# EasyEDA Pro project MSPM0G3507.eprj, board V1
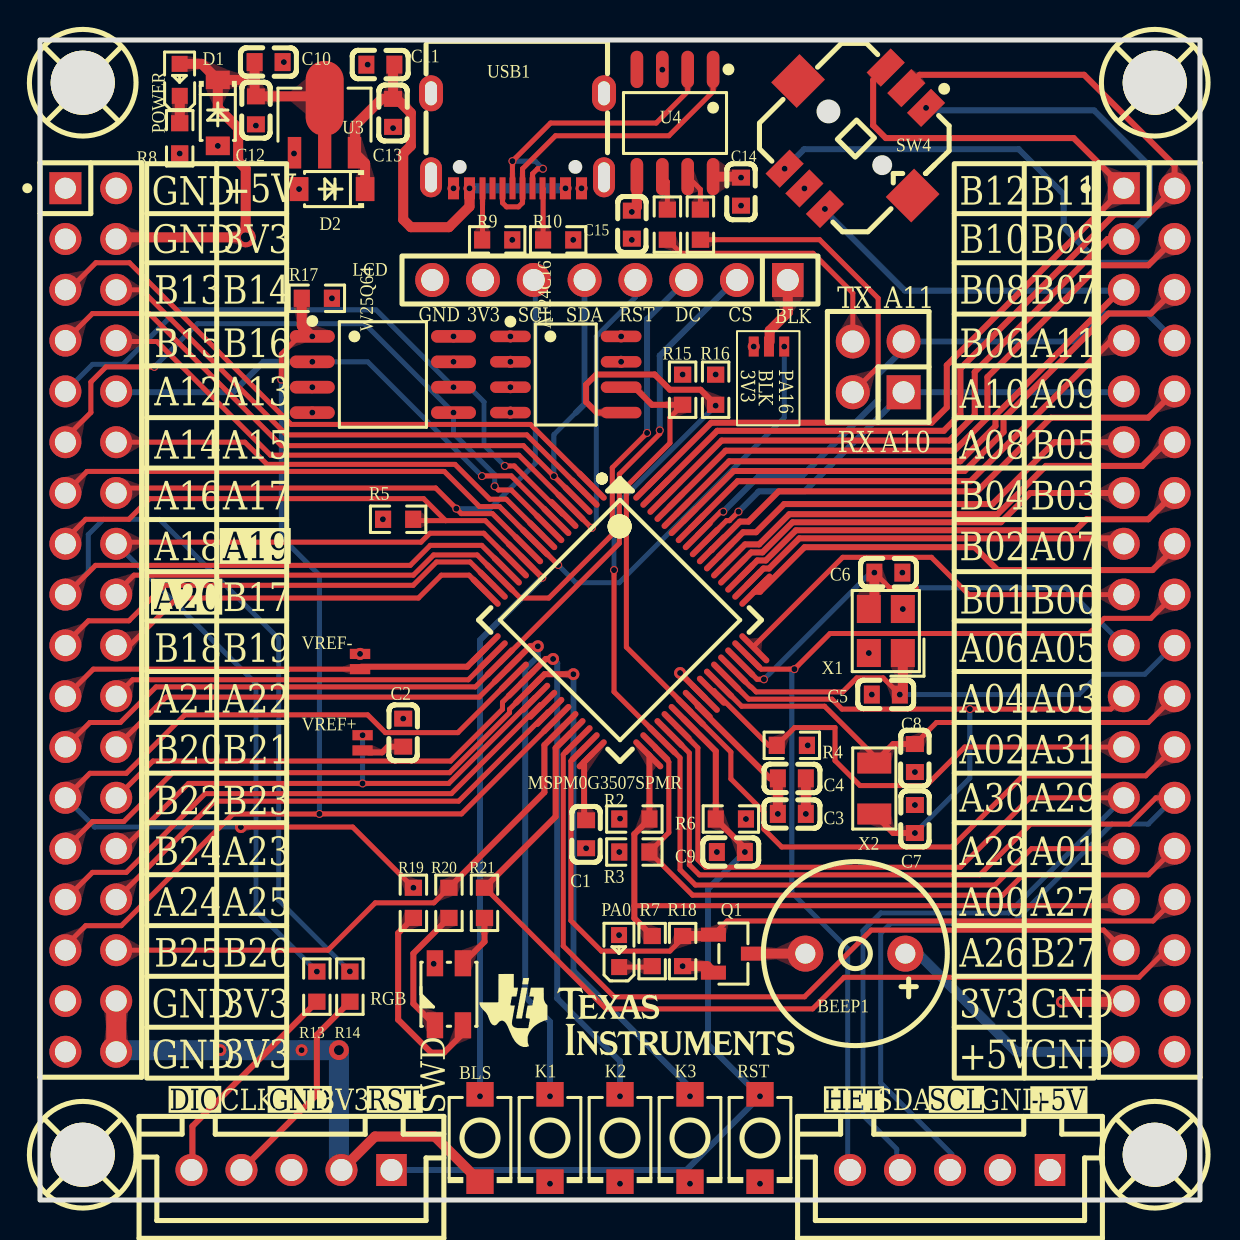
[diagram p1: board, top side]
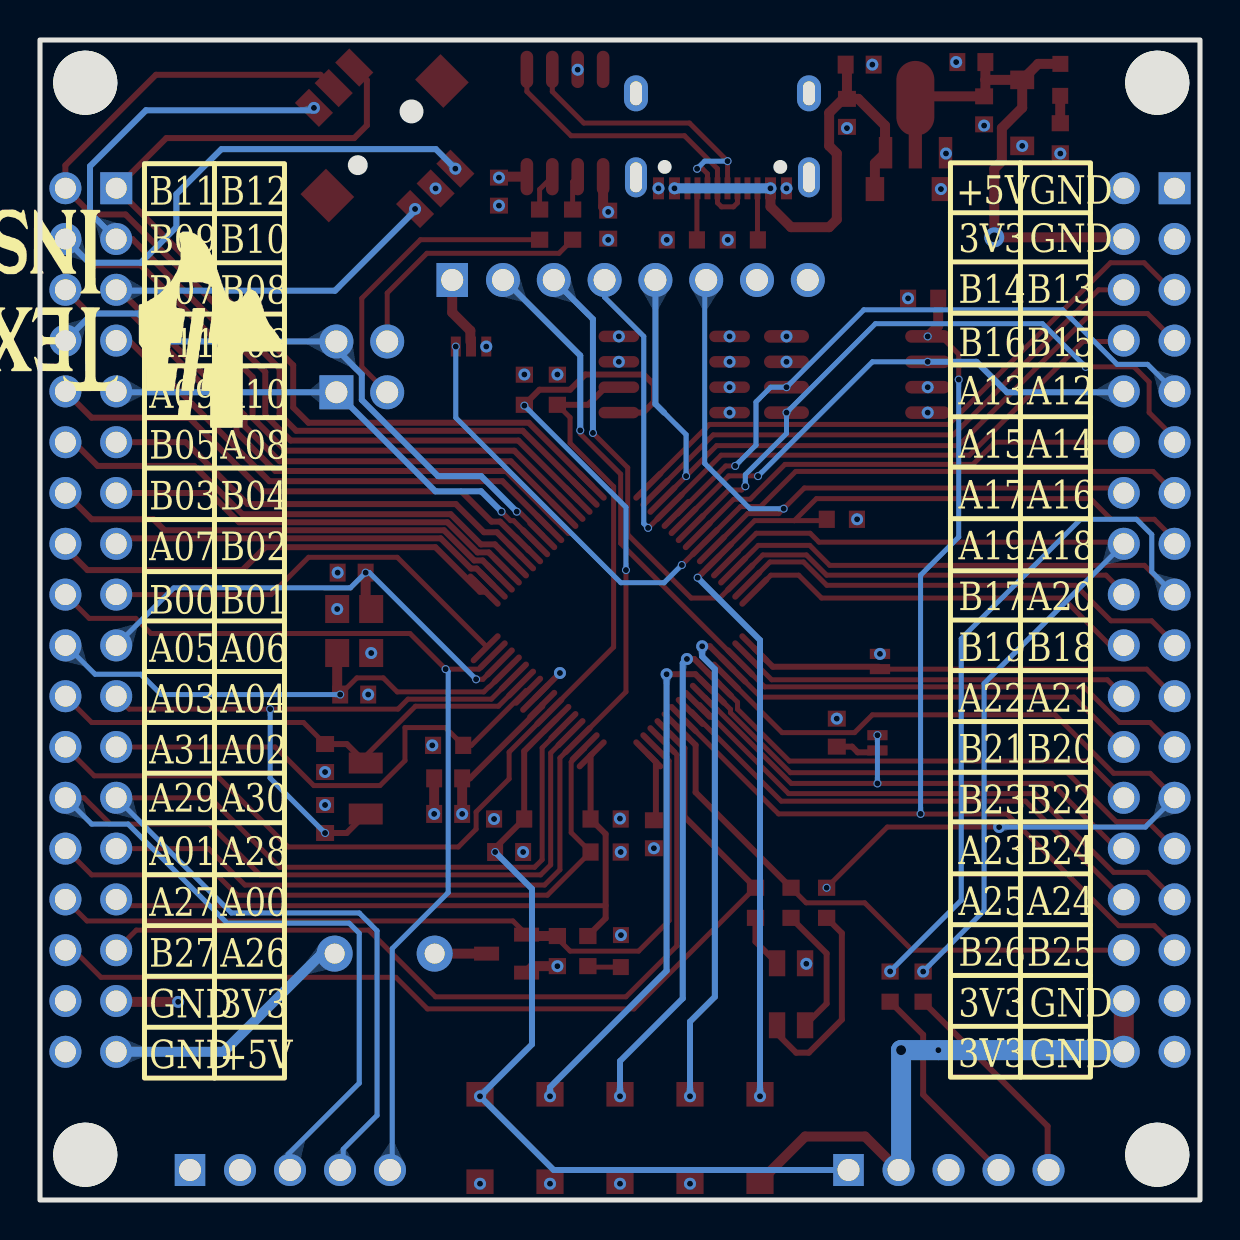
[diagram p2: board, bottom side, seen from below]

Outline 58 x 58 mm; copper layers: Top Layer, GND, VCC, Bottom Layer. Coordinates in mm from the lower left corner of the outline.
Outline path: rectangle 0,58 58,0
Stack: Top Layer 0.035mm / Dielectric1 0.48mm PP er 4.5 / GND 0.035mm / Dielectric2 0.48mm FR4 er 4.5 / VCC 0.035mm / Dielectric3 0.48mm PP er 4.5 / Bottom Layer 0.035mm

## Design rules (mm)
template: JLCPCB Capability(Multiple Layers Board)
spacing copperThickness1oz (default): track to track 0.102, other pairs 0.152 to 0.3
spacing copperThickness2oz: track to track 0.203, other pairs 0.152 to 0.3
spacing copperThicknessInner0.5oz: track to track 0.089, other pairs 0.152 to 0.3
track width copperThickness1oz (default): min 0.102, default 0.254, max 2.54
track width copperThickness2oz: min 0.203, default 0.254, max 2.54
track width copperThickness0.5oz: min 0.089, default 0.254, max 2.54
differential pair differentialPair (default): width min 0.127, default 0.254, max 2.54; gap min 0.152, default 0.152
via viaSize (default): diameter min 0.3, default 0.61, max 10; hole min 0.2, default 0.305, max 6.3

## Placement (name value [footprint] x y rotation side)
AT24C16  AT24C16  [SOP-8_L5.0-W4.0-P1.27-LS6.0-BL]  26.29 41.28 270 top
BEEP1  3kHz  [BUZ-TH_BD9.0-P5.00-D0.6-FD]  40.77 12.32 180 top
BL/SDO1  -  [3焊盘短接]  37.47 42.16 90 top
BLS  BSL  [SW-SMD_L3.9-W3.0-P4.45]  22 3.1 270 top
C1  470nF  [C0603]  27.31 18.29 90 top
C2  1uF  [C0603]  18.16 23.37 90 top
C3  1uF  [C0603]  37.59 19.3 180 top
C4  100nF  [C0603]  37.59 21.08 180 top
C5  22pF  [C0603]  42.29 25.27 0 top
C6  22pF  [C0603]  42.42 31.37 180 top
C7  22pF  [C0603]  43.75 19.05 270 top
C8  22pF  [C0603]  43.75 22.1 90 top
C9  10nF  [C0603]  34.54 17.4 0 top
C10  22uF  [C0603]  11.43 56.9 0 top
C11  22uF  [C0603]  17.02 56.77 0 top
C12  100nF  [C0603]  10.79 54.48 270 top
C13  100nF  [C0603]  17.65 54.36 90 top
C14  100nF  [C0603]  35.05 50.42 90 top
C15  100nF  [C0603]  29.59 48.77 270 top
CBSL1  PZ254V-12-4P  [HDR-TH_4P-P2.54-V-M-R2-C2-S2.54]  41.91 41.66 90 top
D1  K34  [SOD-123FL_L2.8-W1.8-LS3.7-RD-1]  8.89 54.36 270 top
D2  K34  [SOD-123FL_L2.8-W1.8-LS3.7-RD-1]  14.6 50.55 180 top
H1  X6521WV-2x18H-C60D30  [HDR-TH_36P-2.54-V-M-R2-C18-S2.54]  2.54 29 270 top
H2  X6521WV-2x18H-C60D30  [HDR-TH_36P-2.54-V-M-R2-C18-S2.54]  55.46 29 270 top
IMU1  imu  [CONN-TH_5P-P2.50_ZX-XH2.54-5PZZ]  45.5 1.5 180 top
K1  K1  [SW-SMD_L3.9-W3.0-P4.45]  25.5 3.1 270 top
K2  K2  [SW-SMD_L3.9-W3.0-P4.45]  29 3.1 270 top
K3  K3  [SW-SMD_L3.9-W3.0-P4.45]  32.5 3.1 270 top
LCD  PM254-1-08-Z-8.5  [HDR-TH_8P-P2.54-V-F]  28.5 46 180 top
MSPM0G3507SPMR  MSPM0G3507SPMR  [LQFP-64_L10.0-W10.0-P0.50-LS12.0-BL]  29 29 225 top
PA0  LED  [LED0603-RD_RED]  28.96 12.45 90 top
POWER  NCD0603R1  [LED0603-RD_RED]  6.98 56.01 90 top
Q1  SI2302  [SOT-23-3_L2.9-W1.3-P1.90-LS2.4-BR]  34.67 12.32 180 top
R2  4.7kΩ  [R0603]  29.72 19.05 0 top
R3  4.7kΩ  [R0603]  29.72 17.4 0 top
R4  100kΩ  [R0603]  37.59 22.73 0 top
R5  47kΩ  [R0603]  17.91 34.04 0 top
R6  47kΩ  [R0603]  34.54 19.05 0 top
R7  510Ω  [R0603]  30.61 12.45 270 top
R8  510Ω  [R0603]  6.98 53.09 270 top
R9  5.1kΩ  [R0603]  22.86 48.01 0 top
R10  5.1kΩ  [R0603]  25.91 48.01 0 top
R11  1.2kΩ  [R0603]  33.02 48.77 270 top
R12  1.2kΩ  [R0603]  31.37 48.77 270 top
R13  100Ω  [R0603]  13.84 10.67 90 top
R14  100Ω  [R0603]  15.49 10.67 90 top
R15  4.7kΩ  [R0603]  32.13 40.51 90 top
R16  4.7kΩ  [R0603]  33.78 40.51 90 top
R17  4.7kΩ  [R0603]  13.84 45.08 0 top
R18  10kΩ  [R0603]  32.13 12.45 90 top
R19  510Ω  [R0603]  18.67 14.86 270 top
R20  510Ω  [R0603]  20.45 14.86 270 top
R21  510Ω  [R0603]  22.22 14.86 270 top
RGB  RGB  [LED-ARRAY-SMD_4P-L3.2-W2.8-LS3.5-BL_XL-A3528RGBC-BM]  20.45 10.29 270 top
RST  RST  [SW-SMD_L3.9-W3.0-P4.45]  36 3.1 270 top
SCREW1  -  [M3螺丝]  2.2 2.2 0 top
SCREW2  -  [M3螺丝]  2.2 55.8 0 top
SCREW3  -  [M3螺丝]  55.8 55.8 0 top
SCREW4  -  [M3螺丝]  55.8 2.2 0 top
SW4  TM-4175-B-A  [SW-SMD_TM-4175-B-X]  40.77 53.09 225 top
SWD  swd  [CONN-TH_5P-P2.50_ZX-XH2.54-5PZZ]  12.57 1.5 180 top
U3  AMS1117-3.3  [SOT-89_L4.5-W2.5-P1.50-LS4.2-BR]  14.22 53.72 270 top
U4  CH340N  [SOP-8_L4.9-W3.9-P1.27-LS6.0-BL]  31.75 53.85 180 top
USB1  TYPE-C 16PIN 2MD(073)  [USB-C-SMD_TYPE-C-6PIN-2MD-073]  23.88 52.96 180 top
VREF+  -  [VREF]  15.62 22.22 0 top
VREF-  -  [VREF]  15.49 26.29 0 top
W25Q64  W25Q64  [SOIC-8_L5.3-W5.3-P1.27-LS8.0-BL]  17.15 41.28 270 top
X1  40MHz  [CRYSTAL-SMD_4P-L3.2-W2.5-BL]  42.29 28.45 90 top
X2  32.768kHz  [OSC-SMD_L3.2-W1.5]  41.71 20.57 90 top

## Footprints (pads in the part's own frame, mm; a bottom-side part is the same pattern mirrored in y, then rotated)
3焊盘短接
  custom 1x0.5 smd: 1(0.508,1.778) 2(0.508,1.016) 3(0.508,0.254)
BUZ-TH_BD9.0-P5.00-D0.6-FD
  round 1.8 hole 1: 1(-2.5,0) 2(2.5,0)
C0603
  rect 0.8x0.9 smd: 1(-0.7,0) 2(0.7,0)
CONN-TH_5P-P2.50_ZX-XH2.54-5PZZ
  rect 1.524x1.6 hole 1.1: 1(-5,0)
  round 1.6 hole 1.1: 2(-2.5,0) 3(0,0) 4(2.5,0) 5(5,0)
CRYSTAL-SMD_4P-L3.2-W2.5-BL
  rect 1.4x1.2 smd: 1(-1.1,-0.85) 2(1.1,-0.85) 3(1.1,0.85) 4(-1.1,0.85)
HDR-TH_4P-P2.54-V-M-R2-C2-S2.54
  rect 1.7x1.7 hole 1.1: 1(-1.27,-1.27)
  round 1.7 hole 1.1: 2(-1.27,1.27) 3(1.27,-1.27) 4(1.27,1.27)
HDR-TH_8P-P2.54-V-F
  rect 1.575x1.7 hole 1.1: 1(-8.89,0)
  round 1.7 hole 1.1: 2(-6.35,0) 3(-3.81,0) 4(-1.27,0) 5(1.27,0) 6(3.81,0) 7(6.35,0) 8(8.89,0)
HDR-TH_36P-2.54-V-M-R2-C18-S2.54
  rect 1.6x1.6 hole 1.05: 1(-21.59,-1.27)
  round 1.6 hole 1.05: 2(-21.59,1.27) 3(-19.05,-1.27) 4(-19.05,1.27) 5(-16.51,-1.27) 6(-16.51,1.27) 7(-13.97,-1.27) 8(-13.97,1.27) 9(-11.43,-1.27) 10(-11.43,1.27) 11(-8.89,-1.27) 12(-8.89,1.27) 13(-6.35,-1.27) 14(-6.35,1.27) 15(-3.81,-1.27) 16(-3.81,1.27) 17(-1.27,-1.27) 18(-1.27,1.27) 19(1.27,-1.27) 20(1.27,1.27) 21(3.81,-1.27) 22(3.81,1.27) 23(6.35,-1.27) 24(6.35,1.27) 25(8.89,-1.27) 26(8.89,1.27) 27(11.43,-1.27) 28(11.43,1.27) 29(13.97,-1.27) 30(13.97,1.27) 31(16.51,-1.27) 32(16.51,1.27) 33(19.05,-1.27) 34(19.05,1.27) 35(21.59,-1.27) 36(21.59,1.27)
LED0603-RD_RED
  rect 0.8x0.8 smd: 1(-0.799,-0.004) 2(0.799,0.004)
LED-ARRAY-SMD_4P-L3.2-W2.8-LS3.5-BL_XL-A3528RGBC-BM
  rect 1.3x0.82 smd: 1(-1.55,-0.7) 2(-1.55,0.7) 3(1.55,-0.7) 4(1.55,0.7)
LQFP-64_L10.0-W10.0-P0.50-LS12.0-BL
  oval 0.3x2 smd: 1(-3.75,-5.75) 2(-3.25,-5.75) 3(-2.75,-5.75) 4(-2.25,-5.75) 5(-1.75,-5.75) 6(-1.25,-5.75) 7(-0.75,-5.75) 8(-0.25,-5.75) 9(0.25,-5.75) 10(0.75,-5.75) 11(1.25,-5.75) 12(1.75,-5.75) 13(2.25,-5.75) 14(2.75,-5.75) 15(3.25,-5.75) 16(3.75,-5.75) 33(3.75,5.75) 34(3.25,5.75) 35(2.75,5.75) 36(2.25,5.75) 37(1.75,5.75) 38(1.25,5.75) 39(0.75,5.75) 40(0.25,5.75) 41(-0.25,5.75) 42(-0.75,5.75) 43(-1.25,5.75) 44(-1.75,5.75) 45(-2.25,5.75) 46(-2.75,5.75) 47(-3.25,5.75) 48(-3.75,5.75)
  oval 2x0.3 smd: 17(5.75,-3.75) 18(5.75,-3.25) 19(5.75,-2.75) 20(5.75,-2.25) 21(5.75,-1.75) 22(5.75,-1.25) 23(5.75,-0.75) 24(5.75,-0.25) 25(5.75,0.25) 26(5.75,0.75) 27(5.75,1.25) 28(5.75,1.75) 29(5.75,2.25) 30(5.75,2.75) 31(5.75,3.25) 32(5.75,3.75) 49(-5.75,3.75) 50(-5.75,3.25) 51(-5.75,2.75) 52(-5.75,2.25) 53(-5.75,1.75) 54(-5.75,1.25) 55(-5.75,0.75) 56(-5.75,0.25) 57(-5.75,-0.25) 58(-5.75,-0.75) 59(-5.75,-1.25) 60(-5.75,-1.75) 61(-5.75,-2.25) 62(-5.75,-2.75) 63(-5.75,-3.25) 64(-5.75,-3.75)
M3螺丝
  round 3.2 hole 3.2: 1(-0.064,0.064)
OSC-SMD_L3.2-W1.5
  rect 1.05x1.7 smd: 1(-1.275,0) 2(1.275,0)
R0603
  rect 0.806x0.864 smd: 1(-0.753,0) 2(0.753,0)
SOD-123FL_L2.8-W1.8-LS3.7-RD-1
  rect 0.93x1.2 smd: 1(-1.65,0) 2(1.65,0)
SOIC-8_L5.3-W5.3-P1.27-LS8.0-BL
  oval 0.63x2.25 smd: 1(-1.905,-3.53) 2(-0.635,-3.53) 3(0.635,-3.53) 4(1.905,-3.53) 5(1.905,3.53) 6(0.635,3.53) 7(-0.635,3.53) 8(-1.905,3.53)
SOP-8_L4.9-W3.9-P1.27-LS6.0-BL
  oval 0.63x1.865 smd: 1(-1.905,-2.683) 2(-0.635,-2.683) 3(0.635,-2.683) 4(1.905,-2.683) 5(1.905,2.683) 6(0.635,2.683) 7(-0.635,2.683) 8(-1.905,2.683)
SOP-8_L5.0-W4.0-P1.27-LS6.0-BL
  oval 0.574x2.035 smd: 1(-1.905,-2.768) 2(-0.635,-2.768) 3(0.635,-2.768) 4(1.905,-2.768) 5(1.905,2.768) 6(0.635,2.768) 7(-0.635,2.768) 8(-1.905,2.768)
SOT-23-3_L2.9-W1.3-P1.90-LS2.4-BR
  rect 1.25x0.7 smd: 1(1,-0.95) 2(1,0.95) 3(-1,0)
SOT-89_L4.5-W2.5-P1.50-LS4.2-BR
  rect 1.575x0.672 smd: 1(1.356,-1.5) 3(1.356,1.5)
  custom 5.377x1.9 smd: 2(-1.356,0.009)
SW-SMD_L3.9-W3.0-P4.45
  rect 1.23x1.36 smd: 1(-2.185,0) 2(2.185,0)
SW-SMD_TM-4175-B-X
  rect 1.7x1 smd: 1(-3.575,1.425) 2(-3.575,0.028) 3(-3.575,-1.425) 4(3.575,1.425) 5(3.575,-0.028) 6(3.575,-1.425)
  rect 2x1.8 smd: 7(0,4.05) 7(0,-4.05)
USB-C-SMD_TYPE-C-6PIN-2MD-073
  rect 0.55x1.1 smd: 1(-3.2,2.375) 2(-2.4,2.375) 11(2.4,2.375) 12(3.2,2.375)
  rect 0.3x1.1 smd: 3(-1.75,2.375) 4(-1.25,2.375) 5(-0.75,2.375) 6(-0.25,2.375) 7(0.25,2.375) 8(0.75,2.375) 9(1.25,2.375) 10(1.75,2.375)
  oval 1.1x2 hole 0.6x1.5: 13(-4.325,1.825) 14(4.325,1.825)
  oval 1.2x1.8 hole 0.6x1.2: 13(-4.325,-2.375) 14(4.325,-2.375)
VREF
  custom 1.016x0.508 smd: 1(0.508,1.016) 2(0.508,0.254)

## Nets
3V3: AT24C16.8 BL/SDO1.1 BLS.2 C3.2 C4.2 C10.1 C12.1 C14.2 C15.1 D1.1 H1.4 H1.34 H1.36 H2.33 LCD.7 MSPM0G3507SPMR.40 PA0.2 POWER.2 R2.1 R3.1 R6.2 R15.2 R16.2 R17.2 SWD.2 U3.2 U4.5 U4.8 W25Q64.3 W25Q64.7 W25Q64.8
GND: AT24C16.1 AT24C16.2 AT24C16.3 AT24C16.4 AT24C16.7 C1.1 C2.2 C3.1 C4.1 C5.1 C6.1 C7.1 C8.1 C9.1 C10.2 C11.1 C12.2 C13.1 C14.1 C15.2 D1.2 D2.2 H1.1 H1.3 H1.33 H1.35 H2.34 H2.36 IMU1.2 K1.2 K2.2 K3.2 LCD.8 MSPM0G3507SPMR.41 Q1.2 R4.2 R5.1 R8.2 R9.2 R10.2 R18.1 RGB.1 RST.2 SW4.5 SWD.3 U3.1 U4.3 USB1.1 USB1.12 USB1.13 USB1.14 VREF-.1 W25Q64.4 X1.2 X1.4
VCC_5V: BEEP1.1 C11.2 C13.2 D2.1 H1.2 H2.35 IMU1.1 U3.3 USB1.2 USB1.11
A0_PWM_CH0: H1.6 MSPM0G3507SPMR.2
A0_PWM_CH1: C8.2 H2.22 MSPM0G3507SPMR.43 X2.2
A0_PWM_CH2: H2.16 MSPM0G3507SPMR.49
A0_PWM_CH3: C7.2 H2.21 MSPM0G3507SPMR.44 X2.1
A1_PWM_CH0: H1.12 MSPM0G3507SPMR.8
A1_PWM_CH1: H2.17 MSPM0G3507SPMR.48
ADC_VBAT: H2.31 MSPM0G3507SPMR.30
BEEP: H2.30 MSPM0G3507SPMR.31 Q1.1 R18.2
BOOT: BLS.1 H1.15 MSPM0G3507SPMR.11 R5.2
BUTTON_1: H2.5 MSPM0G3507SPMR.60 SW4.4
BUTTON_2: H2.4 MSPM0G3507SPMR.61 SW4.6
BUTTON_3: H2.3 MSPM0G3507SPMR.62 SW4.1
BUTTON_4: H2.2 MSPM0G3507SPMR.63 SW4.2
BUTTON_5: H2.1 MSPM0G3507SPMR.64 SW4.3
EEPROM_SCL: AT24C16.6 H2.24 MSPM0G3507SPMR.39 R15.1
EEPROM_SDA: AT24C16.5 H2.27 MSPM0G3507SPMR.35 R16.1
G7_PWM_CH0: H1.28 MSPM0G3507SPMR.24 VREF+.1
G7_PWM_CH1: H2.23 MSPM0G3507SPMR.42 R4.1
HEATER: H2.18 IMU1.5 MSPM0G3507SPMR.47
HFIN: C5.2 H2.20 MSPM0G3507SPMR.45 X1.1
HFOUT: C6.2 H2.19 MSPM0G3507SPMR.46 X1.3
K1: H1.24 K1.1 MSPM0G3507SPMR.20
K2: H1.26 K2.1 MSPM0G3507SPMR.22
K3: H1.27 K3.1 MSPM0G3507SPMR.23
LCD_BLK: BL/SDO1.2 LCD.1
LCD_CS: H1.23 LCD.2 MSPM0G3507SPMR.19
LCD_DC: H1.18 LCD.3 MSPM0G3507SPMR.14
LCD_RES: H1.8 LCD.4 MSPM0G3507SPMR.4
LCD_SCL: H1.14 LCD.6 MSPM0G3507SPMR.10
LCD_SDA: H1.7 LCD.5 MSPM0G3507SPMR.3
NRST: C9.2 MSPM0G3507SPMR.38 R6.1 RST.1 SWD.1
PA0: H2.29 MSPM0G3507SPMR.33 R2.2 R7.1
PA1: H2.28 MSPM0G3507SPMR.34 R3.2
PA8: H2.11 MSPM0G3507SPMR.54
PA9: H2.10 MSPM0G3507SPMR.55
PA10: CBSL1.1 H2.9 MSPM0G3507SPMR.56
PA11: CBSL1.3 H2.8 MSPM0G3507SPMR.57
PA12: H1.9 MSPM0G3507SPMR.5 W25Q64.6
PA13: H1.10 MSPM0G3507SPMR.6 W25Q64.2
PA14: H1.11 MSPM0G3507SPMR.7 W25Q64.5
PA16: BL/SDO1.3 H1.13 MSPM0G3507SPMR.9
PA19: H1.16 MSPM0G3507SPMR.12 R13.2
PA20: H1.17 MSPM0G3507SPMR.13 R14.2
PA21: H1.21 MSPM0G3507SPMR.17 VREF-.2
PA22: H1.22 MSPM0G3507SPMR.18
PA24: H1.29 MSPM0G3507SPMR.25
PA25: H1.30 MSPM0G3507SPMR.26
PA29: H2.26 IMU1.3 MSPM0G3507SPMR.36
PA30: H2.25 IMU1.4 MSPM0G3507SPMR.37
PB2: H2.15 MSPM0G3507SPMR.50
PB3: H2.14 MSPM0G3507SPMR.51
PB4: H2.13 MSPM0G3507SPMR.52
PB5: H2.12 MSPM0G3507SPMR.53
PB6: H2.7 MSPM0G3507SPMR.58
PB7: H2.6 MSPM0G3507SPMR.59
PB13: H1.5 MSPM0G3507SPMR.1
PB18: H1.19 MSPM0G3507SPMR.15
PB19: H1.20 MSPM0G3507SPMR.16
PB22: H1.25 MSPM0G3507SPMR.21 R19.1
PB25: H1.31 MSPM0G3507SPMR.27 R17.1 W25Q64.1
PB26: H1.32 MSPM0G3507SPMR.28 R20.1
PB27: H2.32 MSPM0G3507SPMR.29 R21.1
UART0_RX_CH340: CBSL1.2 R11.2
UART0_TX_CH340: CBSL1.4 R12.2
USB_D+: U4.1 USB1.6 USB1.8
USB_D-: U4.2 USB1.5 USB1.7
$1N1665: C1.2 MSPM0G3507SPMR.32
$1N2381: C2.1 VREF+.2
$1N6377: PA0.1 R7.2
$1N6436: R19.2 RGB.4
$1N6469: R20.2 RGB.3
$1N6471: R21.2 RGB.2
$1N7524: POWER.1 R8.1
$1N7809: R9.1 USB1.10
$1N7811: R10.1 USB1.4
$1N8223: R11.1 U4.7
$1N8226: R12.1 U4.6
$1N8469: R13.1 SWD.5
$1N8472: R14.1 SWD.4
$1N10173: BEEP1.2 Q1.3

Pads without a net: SCREW1 1; SCREW2 1; SCREW3 1; SCREW4 1; SW4 7; U4 4; USB1 3 9

## Via types
v1: diameter 0.6, hole 0.3, Top Layer to Bottom Layer, 76 vias
v2: diameter 0.4, hole 0.3, Top Layer to Bottom Layer, 33 vias
v3: diameter 1, hole 0.5, Top Layer to Bottom Layer, 2 vias
v4: diameter 0.4, hole 0.305, Top Layer to Bottom Layer, 1 via

## Routing (per net, layer and track width the routed paths; a pad name or vN(x,y) marks a point on that pad's centre or on a via; arc(x,y) is an arc through that point)
3V3: length 66.3
  Top Layer w0.3: 32.89,24.76 32.89,24.69 36.5,21.08 C4.2
  Top Layer w0.5: H1.4 3.89,48.13 v3(10.29,48.13) 10.29,51.56 9.91,51.94 9.91,53.59 8.89,54.61 D1.1 ; D1.1 10.73,56.01 10.73,56.01 ; D1.1 8.09,56.81 POWER.2 ; v1(51.09,9.91) 54.15,9.91 H2.33 ; C10.1 10.73,56.01 ; 10.73,56.01 10.73,55.25 C12.1 14.13,55.18 U3.2 ; U4.8 35.01,51.17 v1(35.05,51.12) ; BLS.2 19.74,3.17 16.75,3.17 SWD.2 ; v1(29.59,49.4) 29.84,49.66 U4.5 ; v1(36.89,19.3) C4.2
  Top Layer w1: H1.34 H1.36
  Bottom Layer w1: SWD.2 14.95,1.63 v3(14.95,7.49) v1(13.08,7.49) v1(9.02,7.49) 3.89,7.49 H1.36
  vias: v1(13.62,40.64) v1(14.6,45.08) v1(20.68,43.18) v1(20.68,41.91) v1(29,19.07) v1(28.96,17.4) v1(28.95,13.25) v1(29.06,43.18) v1(32.13,41.28) v1(33.78,41.28) v1(35.3,19.05) v1(35.69,42.67)
GND: length 5.2
  Top Layer w0.3: 33.24,25.11 v1(32,26.35)
  Top Layer w0.5: Q1.2 33.35,11.69 v1(32.13,11.69) ; C4.1 v1(38.29,19.3)
  vias: v1(6.98,52.32) v1(8.89,52.7) v1(10.79,53.72) v1(12.19,56.9) v1(12.7,52.32) v1(12.95,50.55) v1(13.62,39.37) v1(16,27.31) v1(16.38,56.77) v1(17.15,34.04) v1(17.65,53.59) v1(18.16,24.07) v1(19.69,11.81) v1(20.68,50.58) v1(23.52,43.18) v1(23.52,41.91) v1(23.52,40.64) v1(23.52,39.37) v1(23.61,48.01) v1(25.5,0.81) v1(26.66,48.01) v1(27.08,50.58) v1(27.31,17.59) v1(29,0.81) v1(29.06,41.91) v1(29.59,48.01) v1(31.12,56.52) v1(32.5,0.81) v1(33.84,17.4) v1(35.05,49.72) v1(36,0.81) v1(38.22,50.58) v1(38.39,22.73) v1(41.44,27.35) v1(41.59,25.27) v1(43.12,31.37) v1(43.14,29.55) v1(43.75,21.4) v1(43.75,19.75)
VCC_5V: length 36.2
  Top Layer w0.5: C13.2 17.65,56.7 C11.2 ; C13.2 17.08,55.06 15.75,53.72 15.75,52.39 15.72,52.36 16.25,51.83 D2.1 ; C13.2 17.84,55.06 18.54,54.36 18.54,52.71 18.16,52.32 18.16,49.02 18.54,48.64 20.45,48.64 21.48,49.67 v1(21.48,50.58)
  Bottom Layer w0.5: 43.9,12.32 48.81,7.41 H2.35 ; v1(26.28,50.58) v1(21.48,50.58)
A0_PWM_CH0: length 27.6
  Top Layer w0.25: MSPM0G3507SPMR.2 24.34,38.25 12.33,38.25 5.07,45.51 H1.6
A0_PWM_CH1: length 26
  Top Layer w0.25: X2.2 41.71,22.2 39.23,24.69 35.08,24.69 MSPM0G3507SPMR.43 ; H2.22 55.42,23.88 44.82,23.88 C8.2
  Top Layer w0.3: C8.2 42.66,22.8 X2.2
A0_PWM_CH2: length 24.1
  Top Layer w0.3: 36.48,31.17 MSPM0G3507SPMR.49 36,30.41 38.23,32.64 46.74,32.64 47.88,31.5 55.63,31.5 56.73,32.6 H2.16
A0_PWM_CH3: length 30.6
  Top Layer w0.25: H2.21 53.55,24.55 v2(46.49,24.55) 40.1,24.55 39.6,25.04 35.43,25.04 MSPM0G3507SPMR.44
  Top Layer w0.3: v2(43.75,18.35) 42.66,18.35 41.71,19.3
  Bottom Layer w0.25: v2(46.49,24.55) 46.49,21.1 v2(43.75,18.35)
A1_PWM_CH0: length 23.2
  Top Layer w0.25: 25.11,33.24 23.31,35.04 22.49,35.04 20.75,36.78 11.35,36.78 10.24,37.89 H1.12
A1_PWM_CH1: length 21.2
  Top Layer w0.25: H2.17 46.44,30.27 44.57,32.14 40.14,32.14 35.72,27.72 MSPM0G3507SPMR.48
ADC_VBAT: length 41.5
  Top Layer w0.25: 26.88,22.99 26.16,22.27 26.16,12.7 28.7,10.16 38.23,10.16 41.56,13.5 53.18,13.5 H2.31
BEEP: length 40.9
  Top Layer w0.25: H2.30 55.65,13.95 34.35,13.95 Q1.1 ; MSPM0G3507SPMR.31 26.54,21.95 26.54,13.97 28.07,12.45 31.5,12.45 32.13,13.08 R18.2
  Top Layer w0.5: R18.2 33.6,13.2 Q1.1
BOOT: length 55.4
  Top Layer w0.25: H1.15 1.27,33.02 2.29,34.04 4.44,34.04 5.48,35.07 19.18,35.07 20.28,33.97 ; 20.28,33.97 18.73,33.97 R5.2 ; 20.28,33.97 22.27,33.97 MSPM0G3507SPMR.11
  Top Layer w0.3: MSPM0G3507SPMR.11 v2(25.12,31.11)
  Bottom Layer w0.3: v2(25.12,31.11) 22,28 v1(22,5.19)
BUTTON_1: length 44
  Top Layer w0.3: H2.5 54.05,45.51 47.77,39.23 47.77,38.7 46.01,36.94 34.46,36.94 MSPM0G3507SPMR.60
  Bottom Layer w0.3: v1(39.25,49.55) 39.25,49.47 43.25,45.47 54.15,45.47 H2.5
BUTTON_2: length 55.7
  Top Layer w0.3: H2.4 55.42,46.74 52.96,46.74 47.37,41.15 47.37,39.12 45.72,37.47 34.28,37.47 31.47,34.66
  Bottom Layer w0.3: v1(37.23,51.57) 38.21,52.54 48.93,52.54 51.18,50.29 51.18,48.64 52.96,46.86 55.54,46.86 H2.4
BUTTON_3: length 46.3
  Top Layer w0.3: 31.12,35.01 34.08,37.97 45.47,37.97 46.74,39.24 46.74,41.4 53.38,48.05 H2.3
  Bottom Layer w0.3: v1(44.3,54.61) 44.43,54.48 52.71,54.48 55.5,51.69 55.5,49.36 H2.3
BUTTON_4: length 50.3
  Top Layer w0.3: SW4.2 43.98,56.26 52.2,56.26 56.73,51.73 H2.2 55.42,49.28 53.72,49.28 46.02,41.58 46.02,39.29 45.19,38.46 33.86,38.46 MSPM0G3507SPMR.63
BUTTON_5: length 48.2
  Top Layer w0.3: MSPM0G3507SPMR.64 33.56,38.86 44.58,38.86 45.34,39.62 45.34,41.74 H2.1 51.68,53.1 42.29,53.1 41.66,53.73 41.66,55.99 SW4.3
EEPROM_SCL: length 51.6
  Top Layer w0.25: H2.24 55.29,21.21 49.15,21.21 45.59,17.65 37.08,17.65 36.19,18.54 36.19,19.4 34.54,21.05 34.54,22.4 MSPM0G3507SPMR.39 32.54,24.43 29.32,27.64 29.32,35.67 31.5,37.85 31.5,39.12 R15.1
  Top Layer w0.3: R15.1 30.6,39.76 29.72,40.64 AT24C16.6
EEPROM_SDA: length 60.1
  Top Layer w0.25: H2.27 49.57,17.57 47.75,15.75 32.77,15.75 32,16.51 32,22.11 31.12,22.99 28.7,25.41 v2(28.7,31.5)
  Top Layer w0.3: AT24C16.5 27.84,39.37 27.31,39.9 27.31,40.77 27.81,41.28 30.73,41.28 31.5,40.51 33.03,40.51 R16.1
  Bottom Layer w0.25: v2(28.7,31.5) 28.7,34.64 v2(33.78,39.72)
G7_PWM_CH0: length 26.5
  Top Layer w0.25: 24.76,25.11 24.72,25.11 20.44,20.83 v2(16.13,20.83) 7.42,20.83 4.16,17.57 H1.28
  Bottom Layer w0.25: v2(16.13,20.83) v2(16.13,23.24)
G7_PWM_CH1: length 25.1
  Top Layer w0.25: MSPM0G3507SPMR.42 33.7,25.46 36.43,22.73 R4.1 37.73,23.62 39.75,23.62 39.75,21.97 41,20.72 44.31,20.72 46.24,22.65 H2.23
HEATER: length 49.5
  Top Layer w0.25: H2.18 55.54,29.08 53.21,29.08 52.46,28.33 39.5,28.33 v2(37.72,26.54) 36.05,26.54 MSPM0G3507SPMR.47
  Bottom Layer w0.25: v2(37.72,26.54) 37.59,26.42 37.59,15.37 40.39,12.57 40.39,1.61 IMU1.5
HFIN: length 26.3
  Top Layer w0.25: 35.56,25.65 35.81,25.4 40.14,25.4 40.84,26.1 42.16,26.1 v2(42.99,25.27) ; 34.66,26.53 35.53,25.65
  Top Layer w0.5: X1.1 43.14,25.42 v2(42.99,25.27)
  Bottom Layer w0.25: H2.20 56.69,27.73 55.25,26.29 52.96,26.29 51.94,25.27 v2(42.99,25.27)
HFOUT: length 27.6
  Top Layer w0.25: v2(41.72,31.37) 42.48,30.61 43.81,30.61 ; 35.01,26.88 35.85,26.03 v2(36.19,26.03)
  Top Layer w0.5: v2(41.72,31.37) 41.72,29.83 X1.3
  Bottom Layer w0.25: v2(36.19,26.03) 41.53,31.37 v2(41.72,31.37) 42.48,30.61 51.31,30.61 H2.19
K1: length 46.4
  Top Layer w0.25: 23.34,26.53 21.96,25.15 6.31,25.15 H1.24
  Top Layer w0.3: v1(24.89,27.69) 24.5,27.69 23.34,26.53
  Bottom Layer w0.3: v1(25.5,5.19) 25.5,8.92 24.26,10.16 24.26,26.54 24.89,27.18 v1(24.89,27.69)
K2: length 48.2
  Top Layer w0.25: MSPM0G3507SPMR.22 23.12,24.89 23.12,24.54 20.53,21.95 5.65,21.95 H1.26
  Top Layer w0.3: MSPM0G3507SPMR.22 25.28,27.05 v1(25.65,27.05)
  Bottom Layer w0.3: v1(29,5.19) 29,6.94 25.86,10.08 25.86,26.84 v1(25.65,27.05)
K3: length 52.6
  Top Layer w0.25: H1.27 2.62,18.92 4.19,18.92 6.63,21.36 20.48,21.36 23.48,24.37 23.48,24.54 MSPM0G3507SPMR.23
  Top Layer w0.3: MSPM0G3507SPMR.23 25.23,26.29 v1(26.67,26.29)
  Bottom Layer w0.3: v1(26.67,26.29) 26.67,11.47 32.5,5.64 v1(32.5,5.19)
LCD_BLK: length 3.5
  Top Layer w0.5: LCD.1 37.39,44.38 36.48,43.47 36.48,42.92
LCD_CS: length 47.6
  Top Layer w0.25: v2(30.99,38.48) 30.99,38.31 28.97,36.29 28.97,32.83 23.01,26.88 22.99,26.88 21.76,25.65 5.8,25.65 4.02,23.88 2.5,23.88 H1.23
  Bottom Layer w0.3: v2(30.99,38.48) 30.99,42.22 34.77,46 LCD.2
LCD_DC: length 42.1
  Top Layer w0.25: v2(30.35,38.35) 28.61,36.61 28.61,33.27 25.44,30.1 24,30.1 24,30.11 22.99,31.12 21.86,32.25 19.68,32.25 18.67,31.24 4.7,31.24 3.81,30.35 H1.18
  Bottom Layer w0.3: v2(30.35,38.35) 30.35,44.04 LCD.3
LCD_RES: length 40.9
  Top Layer w0.25: 27.58,33.61 26.53,34.66 23.94,37.24 11.53,37.24 5.84,42.93 3.85,42.93 H1.8
  Bottom Layer w0.25: LCD.4 29.77,45.14 27.81,43.18 27.81,33.82 v2(27.6,33.61)
LCD_SCL: length 36.1
  Top Layer w0.25: H1.14 4.06,35.6 19.78,35.6 v2(20.82,34.57) 21.06,34.32 22.62,34.32 MSPM0G3507SPMR.10
  Bottom Layer w0.25: v2(20.82,34.57) 22.5,34.57 24.76,36.83 24.76,45.92 LCD.6
LCD_SDA: length 40.5
  Top Layer w0.25: 26.88,35.01 v2(25.69,36.19) 24.17,37.72 12.06,37.72 5.46,44.32 2.62,44.32 H1.7
  Bottom Layer w0.25: v2(25.69,36.19) 25.69,38.27 26.8,39.37
  Bottom Layer w0.3: 26.8,39.37 27.23,39.8 LCD.5
NRST: length 41.9
  Top Layer w0.3: v2(35.24,17.4) 35.24,17.6 R6.1 33.79,22.44 MSPM0G3507SPMR.38
  Bottom Layer w0.3: v2(35.24,17.4) 33.4,15.56 33.4,7.78 v1(36,5.19) 32.31,1.5 SWD.1
PA0: length 34.4
  Top Layer w0.25: H2.29 53.88,14.72 29.72,14.72
  Top Layer w0.3: R7.1 29.72,14.09 29.72,18.3 R2.2 30.47,22.23 MSPM0G3507SPMR.33
PA1: length 34
  Top Layer w0.25: MSPM0G3507SPMR.34 30.77,22.57 31.44,21.9 31.44,18.37 R3.2 32.63,15.24 48.13,15.24 49.15,16.26 55.42,16.26 H2.28
PA8: length 22.6
  Top Layer w0.3: H2.11 50.72,37.89 47.62,34.8 37.21,34.8 35.8,33.39 35.16,33.39 MSPM0G3507SPMR.54
PA9: length 26.5
  Top Layer w0.3: H2.10 55.42,39.12 50.55,39.12 46.86,35.43 36.93,35.43 35.42,33.92 35,33.92 33.56,32.49 33.61,32.55 MSPM0G3507SPMR.55
PA10: length 24.1
  Top Layer w0.25: v2(34.93,34.42) 34.47,33.97 34.32,33.97 33.24,32.89
  Bottom Layer w0.3: v2(34.93,34.42) 35.94,35.43 38.23,35.43 CBSL1.1 54.15,40.39 H2.9
PA11: length 30
  Top Layer w0.25: v2(34.16,34.42) 34.04,34.42 32.89,33.27 32.89,33.24
  Bottom Layer w0.3: v2(34.16,34.42) 35.94,36.19 38.1,36.19 41.91,40 41.91,41.28 43.18,42.55 CBSL1.3 51.69,42.93 53.09,44.32 55.38,44.32 H2.8
PA12: length 32.1
  Top Layer w0.25: MSPM0G3507SPMR.5 26.11,34.3 23.71,36.7 v2(23.24,36.7)
  Bottom Layer w0.25: v2(23.24,36.7) 22.2,37.74 22.2,39.9 21.46,40.64 v2(20.68,40.64) 16.81,44.51 6.87,44.51 4.15,41.78 2.62,41.78 H1.9
PA13: length 26
  Top Layer w0.25: v4(22.1,36.19) 22.11,36.2 23.56,36.2 MSPM0G3507SPMR.6
  Bottom Layer w0.25: v2(13.62,41.91) 16.38,41.91 v4(22.1,36.19)
  Bottom Layer w0.3: H1.10 3.85,40.39 9.65,40.39 11.18,41.91 v2(13.62,41.91)
PA14: length 32.8
  Top Layer w0.25: H1.11 1.27,38.1 2.54,39.37 2.54,40.9 3.3,41.66 v2(5.72,41.66) ; v2(22.73,35.69) 22.92,35.5 23.56,35.5 MSPM0G3507SPMR.7
  Bottom Layer w0.25: v2(22.73,35.69) 22.73,36.27 20.68,38.33 v2(20.68,39.37) 16.23,43.81 7.87,43.81 v2(5.72,41.66)
PA16: length 45.7
  Top Layer w0.25: H1.13 2.35,36.43 20.22,36.43 21.97,34.67 22.98,34.67 24.76,32.89 24.77,32.89 v2(25.91,31.75)
  Bottom Layer w0.25: v2(37.21,42.67) 37.21,39.12 28.96,30.86 26.79,30.86 v2(25.91,31.75)
PA19: length 46.3
  Top Layer w0.25: MSPM0G3507SPMR.12 22.19,33.34 19.49,33.34 19.05,32.89 3.89,32.89 H1.16
  Bottom Layer w0.25: v1(13.84,11.42) 10.79,14.47 10.79,25.83 H1.16
PA20: length 57.5
  Top Layer w0.25: 23.34,31.47 22.09,32.73 19.51,32.73 18.51,31.73 2.78,31.73 1.31,30.27 H1.17
  Bottom Layer w0.25: v1(15.49,11.43) 11.94,14.99 11.94,28.07 5.97,34.04 3.17,34.04 2.41,33.27 2.41,31.41 H1.17
PA21: length 21.9
  Top Layer w0.25: H1.21 1.31,25.19 2.67,26.54 VREF-.2
  Top Layer w0.3: MSPM0G3507SPMR.17 21.36,26.66 16.06,26.66
PA22: length 19.7
  Top Layer w0.25: H1.22 4.63,26.01 21.42,26.01 MSPM0G3507SPMR.18
PA24: length 27.9
  Top Layer w0.25: 25.11,24.76 25.01,24.76 20.57,20.32 8.25,20.32 4.32,16.38 2.62,16.38 H1.29
PA25: length 25.5
  Top Layer w0.25: MSPM0G3507SPMR.26 25.4,24.4 20.94,19.94 8.72,19.94 H1.30
PA29: length 63.9
  Top Layer w0.25: 31.47,23.34 32.47,22.35 32.47,16.76 32.97,16.26 46.99,16.26 49.53,18.8 54.48,18.8 55.8,20.11 H2.26
  Bottom Layer w0.25: H2.26 55.42,18.8 53.59,18.8 48.64,13.84 42.54,13.84 42.04,13.33 42.04,5.84 45.59,2.29 45.59,1.59 IMU1.3
PA30: length 58.5
  Top Layer w0.25: MSPM0G3507SPMR.37 31.83,23.67 32.89,22.61 32.89,17.01 33.27,16.64 46.02,16.64 49.49,20.11 H2.25
  Bottom Layer w0.25: IMU1.4 42.84,1.66 42.84,2.54 41.15,4.23 41.15,13.46 42.04,14.35 48.43,14.35 H2.25
PB2: length 19.9
  Top Layer w0.3: H2.15 53.92,33.08 37.96,33.08 36.46,31.57 36.17,31.57 MSPM0G3507SPMR.50
PB3: length 23.5
  Top Layer w0.3: H2.14 55.42,34.04 52.32,34.04 51.77,33.49 37.8,33.49 36.29,31.98 35.87,31.98 35.01,31.12
PB4: length 21.1
  Top Layer w0.3: H2.13 49.51,35.35 48.05,33.89 37.63,33.89 36.12,32.38 35.56,32.38 34.66,31.47
PB5: length 24.9
  Top Layer w0.3: MSPM0G3507SPMR.53 35.25,32.78 35.96,32.78 37.47,34.29 47.88,34.29 50.29,36.7 55.12,36.7 56.31,37.89 H2.12
PB6: length 25.5
  Top Layer w0.3: H2.7 53.56,42.97 46.53,35.94 34.88,35.94 MSPM0G3507SPMR.58
PB7: length 29.7
  Top Layer w0.3: H2.6 55.54,44.32 53.43,44.32 48.17,39.07 48.18,38.4 46.23,36.45 34.68,36.45 MSPM0G3507SPMR.59
PB13: length 31.5
  Top Layer w0.25: MSPM0G3507SPMR.1 24.53,38.78 12.56,38.78 4.47,46.86 2.79,46.86 1.44,45.51 H1.5
PB18: length 23.6
  Top Layer w0.25: MSPM0G3507SPMR.15 21.5,31.9 19.83,31.9 18.66,30.73 6.22,30.73 4.45,28.96 2.42,28.96 1.27,27.81 H1.19
PB19: length 20.3
  Top Layer w0.25: H1.20 4.49,27.73 6.86,30.1 18.92,30.1 20.07,31.24 21.45,31.24 MSPM0G3507SPMR.16
PB22: length 44.9
  Top Layer w0.25: H1.25 2.5,21.34 4.32,21.34 7.24,24.26 16.38,24.26 17.27,23.37 20.89,23.37 MSPM0G3507SPMR.21 ; v2(18.67,15.61) 15.63,18.65 v1(10.04,18.65)
  Bottom Layer w0.25: H1.25 2.73,18.65 v1(10.04,18.65)
PB25: length 57.3
  Top Layer w0.25: MSPM0G3507SPMR.27 21.07,19.3 v2(13.97,19.3) 13.97,19.3 9.65,19.3 4.06,13.72 2.29,13.72 1.27,12.7 H1.31 ; v2(13.62,43.18) 12.95,43.18 12.06,42.29 v2(12.06,41.02)
  Top Layer w0.5: v2(13.62,43.18) 13.09,43.71 R17.1
  Bottom Layer w0.25: v2(12.06,41.02) 12.06,33.15 13.97,31.24 v2(13.97,19.3)
PB26: length 28.4
  Top Layer w0.25: R20.1 19.69,14.86 16.76,14.86 14.4,12.49 H1.32
  Top Layer w0.3: R20.1 25.22,20.39 25.22,22.75 MSPM0G3507SPMR.28
PB27: length 47.7
  Top Layer w0.25: R21.1 22.24,15.61 28.3,9.55 38.63,9.55 40.21,11.13 54.95,11.13 56.31,12.49 H2.32
  Top Layer w0.3: 26.53,23.34 25.78,22.6 25.78,19.17 R21.1
UART0_RX_CH340: length 15.3
  Top Layer w0.25: CBSL1.2 41.91,41.66 41.91,45.08 38.98,48.01 R11.2
UART0_TX_CH340: length 12.8
  Top Layer w0.25: R12.2 32.05,47.33 38.65,47.33 40.64,45.35 CBSL1.4
USB_D+: length 15.8
  Top Layer w0.25: U4.1 33.66,55.42 31.45,53.21 25.78,53.21 24.13,51.56 USB1.6 24.13,49.86 23.92,49.66 23.33,49.66 23.13,49.86 USB1.8
USB_D-: length 15.7
  Top Layer w0.25: USB1.5 24.63,51.31 24.88,51.56 v2(25.15,51.56) ; USB1.7 23.62,50.59 v2(23.62,51.94) 25.53,53.85 30.81,53.85 32.38,55.42 U4.2
  Bottom Layer w0.25: v2(25.15,51.56) 24.76,51.94 v2(23.62,51.94)
$1N1665: length 3.5
  Top Layer w0.3: C1.2 27.21,19.09 27.21,21.9 MSPM0G3507SPMR.32
$1N2381: length 1.8
  Top Layer w0.3: 16.44,22.38 17.11,22.38 17.4,22.67 C2.1
$1N6377: length 1.7
  Top Layer w0.25: R7.2 30.56,11.65 PA0.1
$1N6436: length 10.1
  Top Layer w0.3: R19.2 17.91,13.34 17.91,9.02 19.56,7.37 20.19,7.37 21.15,8.32 21.15,8.74
$1N6469: length 6.6
  Top Layer w0.3: R20.2 18.67,12.33 18.67,9.81 19.75,8.74
$1N6471: length 2.7
  Top Layer w0.3: R21.2 22.22,12.92 RGB.2
$1N7524: length 1.4
  Top Layer w0.5: 6.99,53.84 POWER.1
$1N7809: length 2.6
  Top Layer w0.25: USB1.10 22.13,48.03 R9.1
$1N7811: length 2.6
  Top Layer w0.25: R10.1 25.15,50.56 USB1.4
$1N8223: length 1.9
  Top Layer w0.25: U4.7 33.02,50.53 R11.1
$1N8226: length 1.7
  Top Layer w0.25: U4.6 31.37,50.91 R12.1
$1N8469: length 11
  Top Layer w0.3: 7.57,1.5 7.62,1.55 7.62,3.69 R13.1
$1N8472: length 10.7
  Top Layer w0.3: R14.1 13.84,8.26 13.84,5.27 SWD.4
$1N10173: length 3.2
  Top Layer w0.5: Q1.3 38.9,12.32

## Copper pours and planes (outline as drawn; the poured copper is in the pictures)
3V3 on VCC: 7.59,53.09 51.93,53.09 51.93,6.14 7.59,6.14
GND on GND: 0.26,57.74 57.74,57.74 57.74,0.26 0.26,0.26
VCC_5V on VCC: 0.26,57.74 57.74,57.74 57.74,0.26 0.26,0.26

Small or netless copper shapes (teardrops, artwork), in the pictures only: 252 on Top Layer, 73 on Bottom Layer, 46 on GND, 16 on VCC

## Text on the board
Bottom Silkscreen Layer: B12 | B10 | B08 | B06 | A10 | A08 | B04 | B02 | B01 | A06 | A04 | A02 | A30 | A28 | A00 | A26 | 3V3 | +5V | B11 | B09 | B07 | A11 | A09 | B05 | B03 | A07 | B00 | A05 | A03 | A31 | A29 | A01 | A27 | B27 | GND | B13 | B15 | A12 | A14 | A16 | A18 | A20 | B18 | A21 | B20 | B22 | B24 | A24 | B25 | B14 | B16 | A13 | A15 | A17 | A19 | B17 | B19 | A22 | B21 | B23 | A23 | A25 | B26
Top Silkscreen Layer: GND | 3V3 | SCL | SDA | RST | DC | CS | BLK | PA16 | DIO | CLK | HET | TX | RX | A10 | A11 | +5V | B13 | B15 | A12 | A14 | A16 | A18 | A20 | B18 | A21 | B20 | B22 | B24 | A24 | B25 | B14 | B16 | A13 | A15 | A17 | A19 | B17 | B19 | A22 | B21 | B23 | A23 | A25 | B26 | B12 | B10 | B08 | B06 | A08 | B04 | B02 | B01 | A06 | A04 | A02 | A30 | A28 | A00 | A26 | B11 | B09 | B07 | A09 | B05 | B03 | A07 | B00 | A05 | A03 | A31 | A29 | A01 | A27 | B27
